# EAGLE design Programmer (EAGLE 8.6.0)
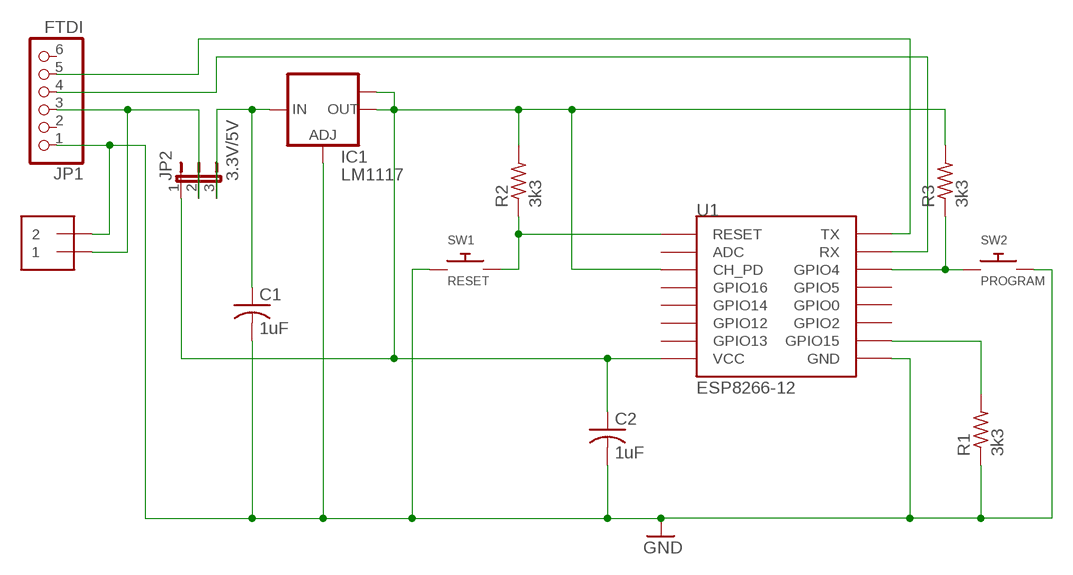
[diagram p0: schematic, sheet 1]

## Parts
C1  1uF  C-USC0805  [C0805]
C2  1uF  C-USC0805  [C0805]
IC1  LM1117  LM1117IMPX-ADJ  [SOT223]
J1  1X2  [1X02]
JP1  FTDI  PINHD-1X6  [1X06]
JP2  3.3V/5V  JP2E  [JP2]
R1  3k3  R-US_M0805  [M0805]
R2  3k3  R-US_M0805  [M0805]
R3  3k3  R-US_M0805  [M0805]
SW1  RESET  SWITCH_PUSHBUTTONSOFTTOUCHSMD_SJ  [PUSHBUTTON_SMD_SJ]
SW2  PROGRAM  SWITCH_PUSHBUTTONSOFTTOUCHSMD_SJ  [PUSHBUTTON_SMD_SJ]
U1  ESP8266-12  ESP12  [ESP12]

## Nets
GND: C1.2 C2.2 IC1.1(ADJ) J1.2 JP1.1 R1.1 SW1.P$1 SW2.P$2 U1.GND
N$1: J1.1 JP1.3 JP2.2
N$2: C1.1 IC1.3(IN) JP2.3
N$3: C2.1 IC1.2(OUT) IC1.TAB(OUT1) JP2.1 R2.2 R3.2 U1.CH_PD U1.VCC
N$5: R2.1 SW1.P$2 U1.RESET
N$7: R1.2 U1.GPIO15
N$8: R3.1 SW2.P$1 U1.GPIO4
N$11: JP1.5 U1.TX
N$12: JP1.4 U1.RX
Unconnected: JP1.2 JP1.6 U1.ADC U1.GPIO0 U1.GPIO2 U1.GPIO5 U1.GPIO12 U1.GPIO13 U1.GPIO14 U1.GPIO16

## Library data of the parts
C1 C2 = resistor:C-US: CAPACITOR, American symbol
IC1 = lm1117:LM1117IMPX-ADJ
J1 = adafruit:1X2: 3.5mm Terminal block http://www.ladyada.net/library/pcb/eaglelibrary.html
JP1 = adafruit:PINHD-1X6: PIN HEADER
JP2 = jumper:JP2E: JUMPER
R1-R3 = rcl:R-US_: RESISTOR, American symbol; SPICEPREFIX: R
SW1 SW2 = adafruit:SWITCH_PUSHBUTTON: Buttons SOFTTOUCHSMD_SJ - Soft touch temporary push button (Super Junk Akihabara) Compatible with SKPMANE010 [Mouser: 688-SKPMAN] C&K_KSS = Digikey: KSS221GLFS
U1 = esp8266modules:ESP12: ESP8266 Wifi module 12

## Board
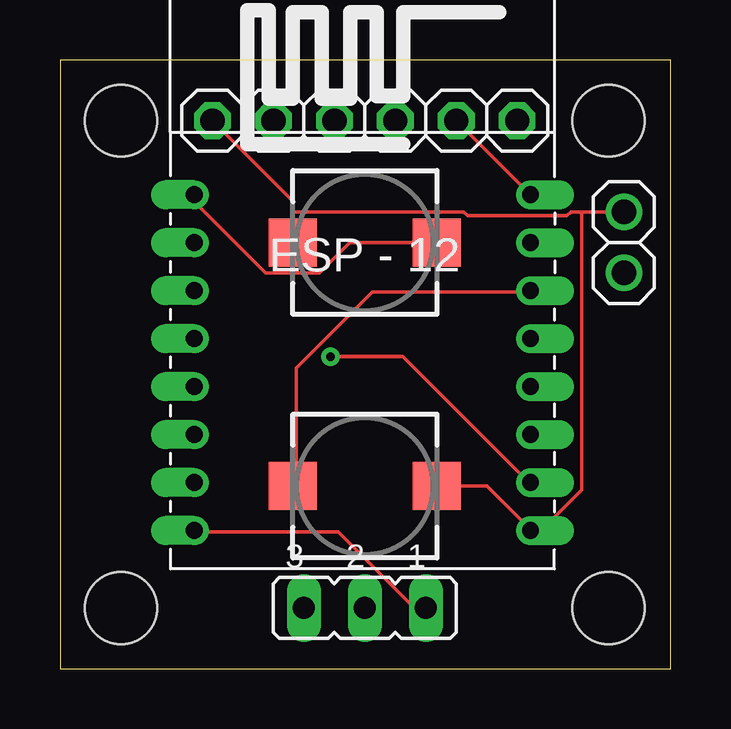
[diagram p1: board, top side]
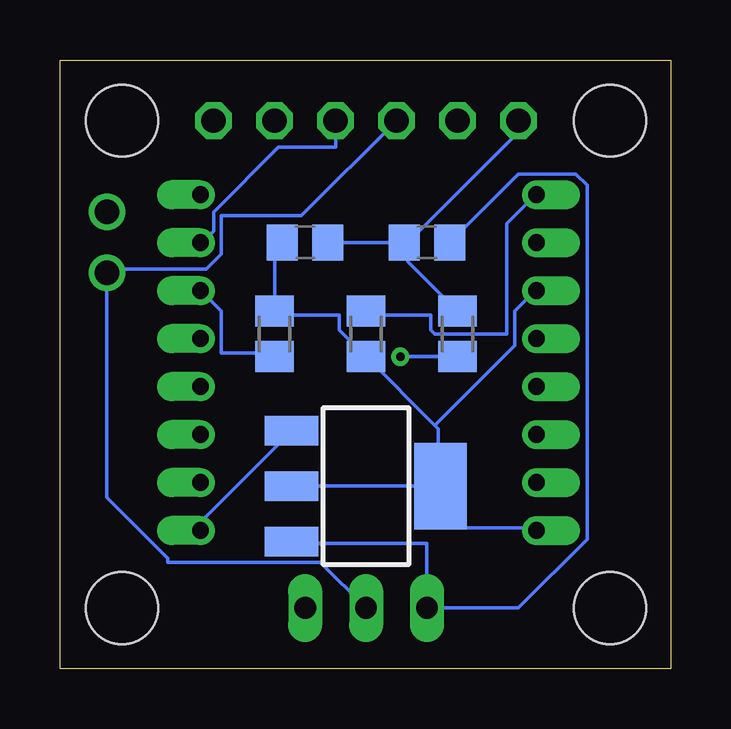
[diagram p2: board, bottom side, seen from below]

Size 25.45 x 25.39 mm. Coordinates in mm from the lower left corner, seen from the top.
Outline: 0,0 25.45,0 25.45,25.39 0,25.39 0,0
Copper layers (1*16): Top 0.035mm / dielectric 1.5mm / Bottom 0.035mm
Design rules "default": minimum track width 6mil, minimum drill 0.35mm, track to track 6mil, track to pad 6mil, pad to pad 6mil, via to via 6mil, smd to smd 6mil, copper to edge 40mil, drill to drill 6mil, minimum pad ring 10mil, minimum via ring 8mil, stop-mask expansion 4mil, vias tented up to drill 0mil, thermal gap 10mil
Holes 3 mm at 2.54,22.86 22.86,22.86 22.86,2.54 2.54,2.54

### Footprints (pad centres in the part's own frame; a part is rotated, then mirrored left to right if it is on the bottom)
C0805 = smd 1.3 x 1.5: 1 -0.95,0; 2 0.95,0
SOT223 = smd 1.219 x 2.235: 1 -2.311,-3.099; 2 0,-3.099; 3 2.311,-3.099 | smd 3.6 x 2.2: TAB 0,3.099
1X02 = drill 1.016: 1 -2.54,0; 2 0,0
1X06 = drill 1.016 octagon: 1 -6.35,0; 2 -3.81,0; 3 -1.27,0; 4 1.27,0; 5 3.81,0; 6 6.35,0
JP2 = drill 0.914 long: 1 -2.54,0; 2 0,0; 3 2.54,0
M0805 = smd 1.3 x 1.6: 1 -0.95,0; 2 0.95,0
PUSHBUTTON_SMD_SJ = smd 2 x 2: P$1 3,0; P$2 -3,0
ESP12 = drill 0.7 offset: ADC -7.1,3.8; CH_PD -7.1,1.8; GND 6.9,-8.2; GPIO0 6.9,-2.2; GPIO2 6.9,-4.2; GPIO4 6.9,1.8; GPIO5 6.9,-0.2; GPIO12 -7.1,-4.2; GPIO13 -7.1,-6.2; GPIO14 -7.1,-2.2; GPIO15 6.9,-6.2; GPIO16 -7.1,-0.2; RESET -7.1,5.8; RX 6.9,3.8; TX 6.9,5.8; VCC -7.1,-8.2

### Placement (x,y rotation side)
C1  10.16,17.78 180 bottom
C2  15.24,17.78 0 bottom
IC1  12.7,7.62 270 bottom
J1  23.5,19.05 90 top
JP1  12.7,22.86 0 top
JP2  12.7,2.54 180 top
R1  8.89,13.97 270 bottom
R2  12.7,13.97 270 bottom
R3  16.51,13.97 90 bottom
SW1  12.7,17.78 180 top
SW2  12.7,7.62 180 top
U1  12.7,13.97 0 top

### Tracks (layer width: path | path; a pad name or v marks a point on that pad's centre or on a via)
GND
  Top 0.152: SW2.P$2 17.78,7.62 19.53,5.87 U1.GND 19.68,5.87 20.16,5.87 21.75,7.46 21.75,19.05 | 9.68,19.05 9.68,19.53 JP1.1 | 9.68,19.05 9.68,17.78 SW1.P$1 | 21.75,19.05 21.27,19.05 21.11,18.89 16.99,18.89 16.83,19.05 9.68,19.05 | 21.75,19.05 J1.2
  Bottom 0.152: IC1.1 15.88,9.84 19.53,6.19 19.53,5.87 U1.GND | C2.2 C1.2 10.95,17.78 | 10.95,17.78 10.95,16.99 R1.1 | 10.95,17.78 6.35,22.38 JP1.1
N$1
  Bottom 0.152: JP2.2 14.61,4.45 20.95,4.45 20.95,4.6 23.5,7.14 J1.1 23.5,16.67 19.37,16.67 18.73,17.3 18.73,18.89 15.4,18.89 JP1.3
N$2
  Bottom 0.152: C1.1 6.35,20.64 3.97,20.64 3.49,20.16 3.49,5.4 6.35,2.54 JP2.3 10.16,5.24 15.72,5.24 IC1.3
N$3
  Top 0.152: JP2.1 14.76,2.54 11.59,5.71 5.71,5.71 U1.VCC
  Bottom 0.152: C2.1 16.51,17.46 R3.2 16.51,14.76 13.81,14.76 13.81,14.13 R2.2 | 9.84,10.16 9.68,10 9.68,7.62 | 9.84,10.16 R2.2 | 9.68,7.62 IC1.2 | 9.68,7.62 IC1.TAB 9.53,7.62 9.53,5.87 5.71,5.87 U1.VCC | 9.84,10.16 6.51,13.49 6.51,14.92 5.71,15.72 U1.CH_PD | R2.2
N$5
  Top 0.152: SW1.P$2 12.06,17.78 10.79,16.51 8.57,16.51 5.71,19.37 5.71,19.68 U1.RESET
  Bottom 0.152: R2.1 12.7,14.76 10,14.76 10,14.13 9.84,13.97 6.83,13.97 6.83,18.57 5.71,19.68 U1.RESET
N$7  (via drill 0.35)
  Top 0.152: v11.27,13.02 14.29,13.02 19.53,7.78 U1.GPIO15
  Bottom 0.152: v11.27,13.02 R1.2
N$8
  Top 0.152: SW2.P$1 9.84,7.62 9.84,12.54 13.02,15.72 19.53,15.72 U1.GPIO4
  Bottom 0.152: R3.1 16.51,13.18 18.73,13.18 18.73,14.92 19.53,15.72 U1.GPIO4
N$11
  Top 0.152: JP1.5 U1.TX
N$12
  Bottom 0.152: JP1.4 13.97,21.75 16.35,21.75 19.05,19.05 19.05,18.26 19.53,17.78 U1.RX

### Text on the board
tDocu: GND | VCC | TX | RX | GND | Reset | VCC | ESP8266 Programmer | @madpilot | Program | Rev 1.0 | 3.3V | 5V